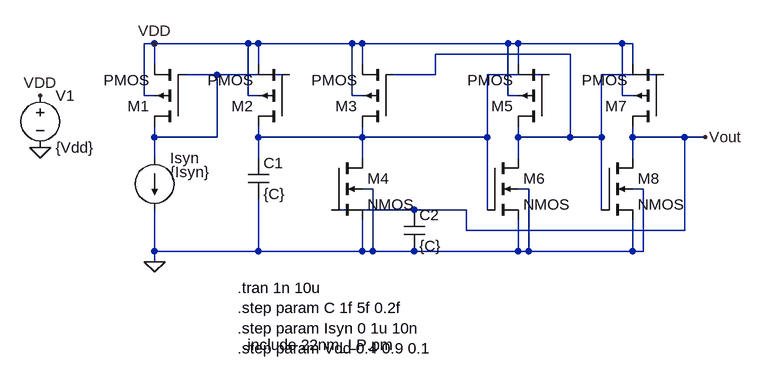
[diagram p0: schematic neuron_22.asc]
neuron_22.asc, the LTspice schematic file:
Version 4
SHEET 1 1680 800
WIRE 512 320 496 320
WIRE 656 320 512 320
WIRE 672 320 656 320
WIRE 816 320 672 320
WIRE 832 320 816 320
WIRE 1056 320 832 320
WIRE 1072 320 1056 320
WIRE 1232 320 1072 320
WIRE 1248 320 1232 320
WIRE 1152 336 944 336
WIRE 512 352 512 320
WIRE 672 352 672 320
WIRE 832 352 832 320
WIRE 1072 352 1072 320
WIRE 1248 352 1248 320
WIRE 608 368 560 368
WIRE 720 368 608 368
WIRE 944 368 944 336
WIRE 944 368 880 368
WIRE 1120 368 1024 368
WIRE 1296 368 1200 368
WIRE 496 400 496 320
WIRE 512 400 496 400
WIRE 656 400 656 320
WIRE 672 400 656 400
WIRE 816 400 816 320
WIRE 832 400 816 400
WIRE 1056 400 1056 320
WIRE 1072 400 1056 400
WIRE 1232 400 1232 320
WIRE 1248 400 1232 400
WIRE 512 464 512 448
WIRE 608 464 608 368
WIRE 608 464 512 464
WIRE 672 464 672 448
WIRE 832 464 832 448
WIRE 832 464 672 464
WIRE 1024 464 1024 368
WIRE 1024 464 832 464
WIRE 1072 464 1072 448
WIRE 1152 464 1152 336
WIRE 1152 464 1072 464
WIRE 1200 464 1200 368
WIRE 1200 464 1152 464
WIRE 1248 464 1248 448
WIRE 1328 464 1248 464
WIRE 1360 464 1328 464
WIRE 512 496 512 464
WIRE 672 496 672 464
WIRE 832 496 832 464
WIRE 1072 496 1072 464
WIRE 1248 496 1248 464
WIRE 848 544 832 544
WIRE 1088 544 1072 544
WIRE 1264 544 1248 544
WIRE 912 576 784 576
WIRE 992 576 912 576
WIRE 1024 576 1024 464
WIRE 1200 576 1200 464
WIRE 992 608 992 576
WIRE 1328 608 1328 464
WIRE 1328 608 992 608
WIRE 512 640 512 576
WIRE 672 640 672 560
WIRE 672 640 512 640
WIRE 832 640 832 592
WIRE 832 640 672 640
WIRE 848 640 848 544
WIRE 848 640 832 640
WIRE 912 640 848 640
WIRE 1072 640 1072 592
WIRE 1072 640 912 640
WIRE 1088 640 1088 544
WIRE 1088 640 1072 640
WIRE 1248 640 1248 592
WIRE 1248 640 1088 640
WIRE 1264 640 1264 544
WIRE 1264 640 1248 640
WIRE 512 656 512 640
FLAG 336 480 0
FLAG 336 400 VDD
FLAG 512 320 VDD
FLAG 512 656 0
FLAG 1360 464 Vout
SYMBOL current 512 496 R0
WINDOW 3 24 22 Left 2
SYMATTR Value {Isyn}
SYMATTR InstName Isyn
SYMBOL Voltage 336 384 R0
SYMATTR InstName V1
SYMATTR Value {Vdd}
SYMBOL Cap 656 496 R0
SYMATTR InstName C1
SYMATTR Value {C}
SYMBOL Cap 896 576 R0
SYMATTR InstName C2
SYMATTR Value {C}
SYMBOL pmos4 560 448 R180
SYMATTR InstName M1
SYMATTR Value2 l=22n w=120n
SYMBOL pmos4 720 448 R180
SYMATTR InstName M2
SYMATTR Value2 l=22n w=120n
SYMBOL pmos4 880 448 R180
SYMATTR InstName M3
SYMATTR Value2 l=22n w=120n
SYMBOL nmos4 784 496 R0
SYMATTR InstName M4
SYMATTR Value2 l=22n w=120n
SYMBOL pmos4 1120 448 R180
SYMATTR InstName M5
SYMATTR Value2 l=22n w=120n
SYMBOL nmos4 1024 496 R0
SYMATTR InstName M6
SYMATTR Value2 l=22n w=120n
SYMBOL pmos4 1296 448 R180
SYMATTR InstName M7
SYMATTR Value2 l=22n w=120n
SYMBOL nmos4 1200 496 R0
SYMATTR InstName M8
SYMATTR Value2 l=22n w=120n
TEXT 640 696 Left 2 !.tran 1n 10u\n.step param C 1f 5f 0.2f\n.step param Isyn 0 1u 10n\n.step param Vdd 0.4 0.9 0.1
TEXT 648 784 Left 2 !.include 22nm_LP.pm

The netlist it stands for:
* neuron_22.asc
Isyn N002 0 {Isyn}
V1 VDD 0 {Vdd}
C1 N003 0 {C}
C2 Vout 0 {C}
M1 N002 N002 VDD VDD PMOS l=22n w=120n
M2 N003 N002 VDD VDD PMOS l=22n w=120n
M3 N003 N001 VDD VDD PMOS l=22n w=120n
M4 N003 Vout 0 0 NMOS l=22n w=120n
M5 N001 N003 VDD VDD PMOS l=22n w=120n
M6 N001 N003 0 0 NMOS l=22n w=120n
M7 Vout N001 VDD VDD PMOS l=22n w=120n
M8 Vout N001 0 0 NMOS l=22n w=120n
.model NMOS NMOS
.model PMOS PMOS
.lib standard.mos
.tran 1n 10u
.step param C 1f 5f 0.2f
.step param Isyn 0 1u 10n
.step param Vdd 0.4 0.9 0.1
.include 22nm_LP.pm
.backanno
.end